# EAGLE schematic car bluetooth v1.1 (EAGLE 9.5.2)
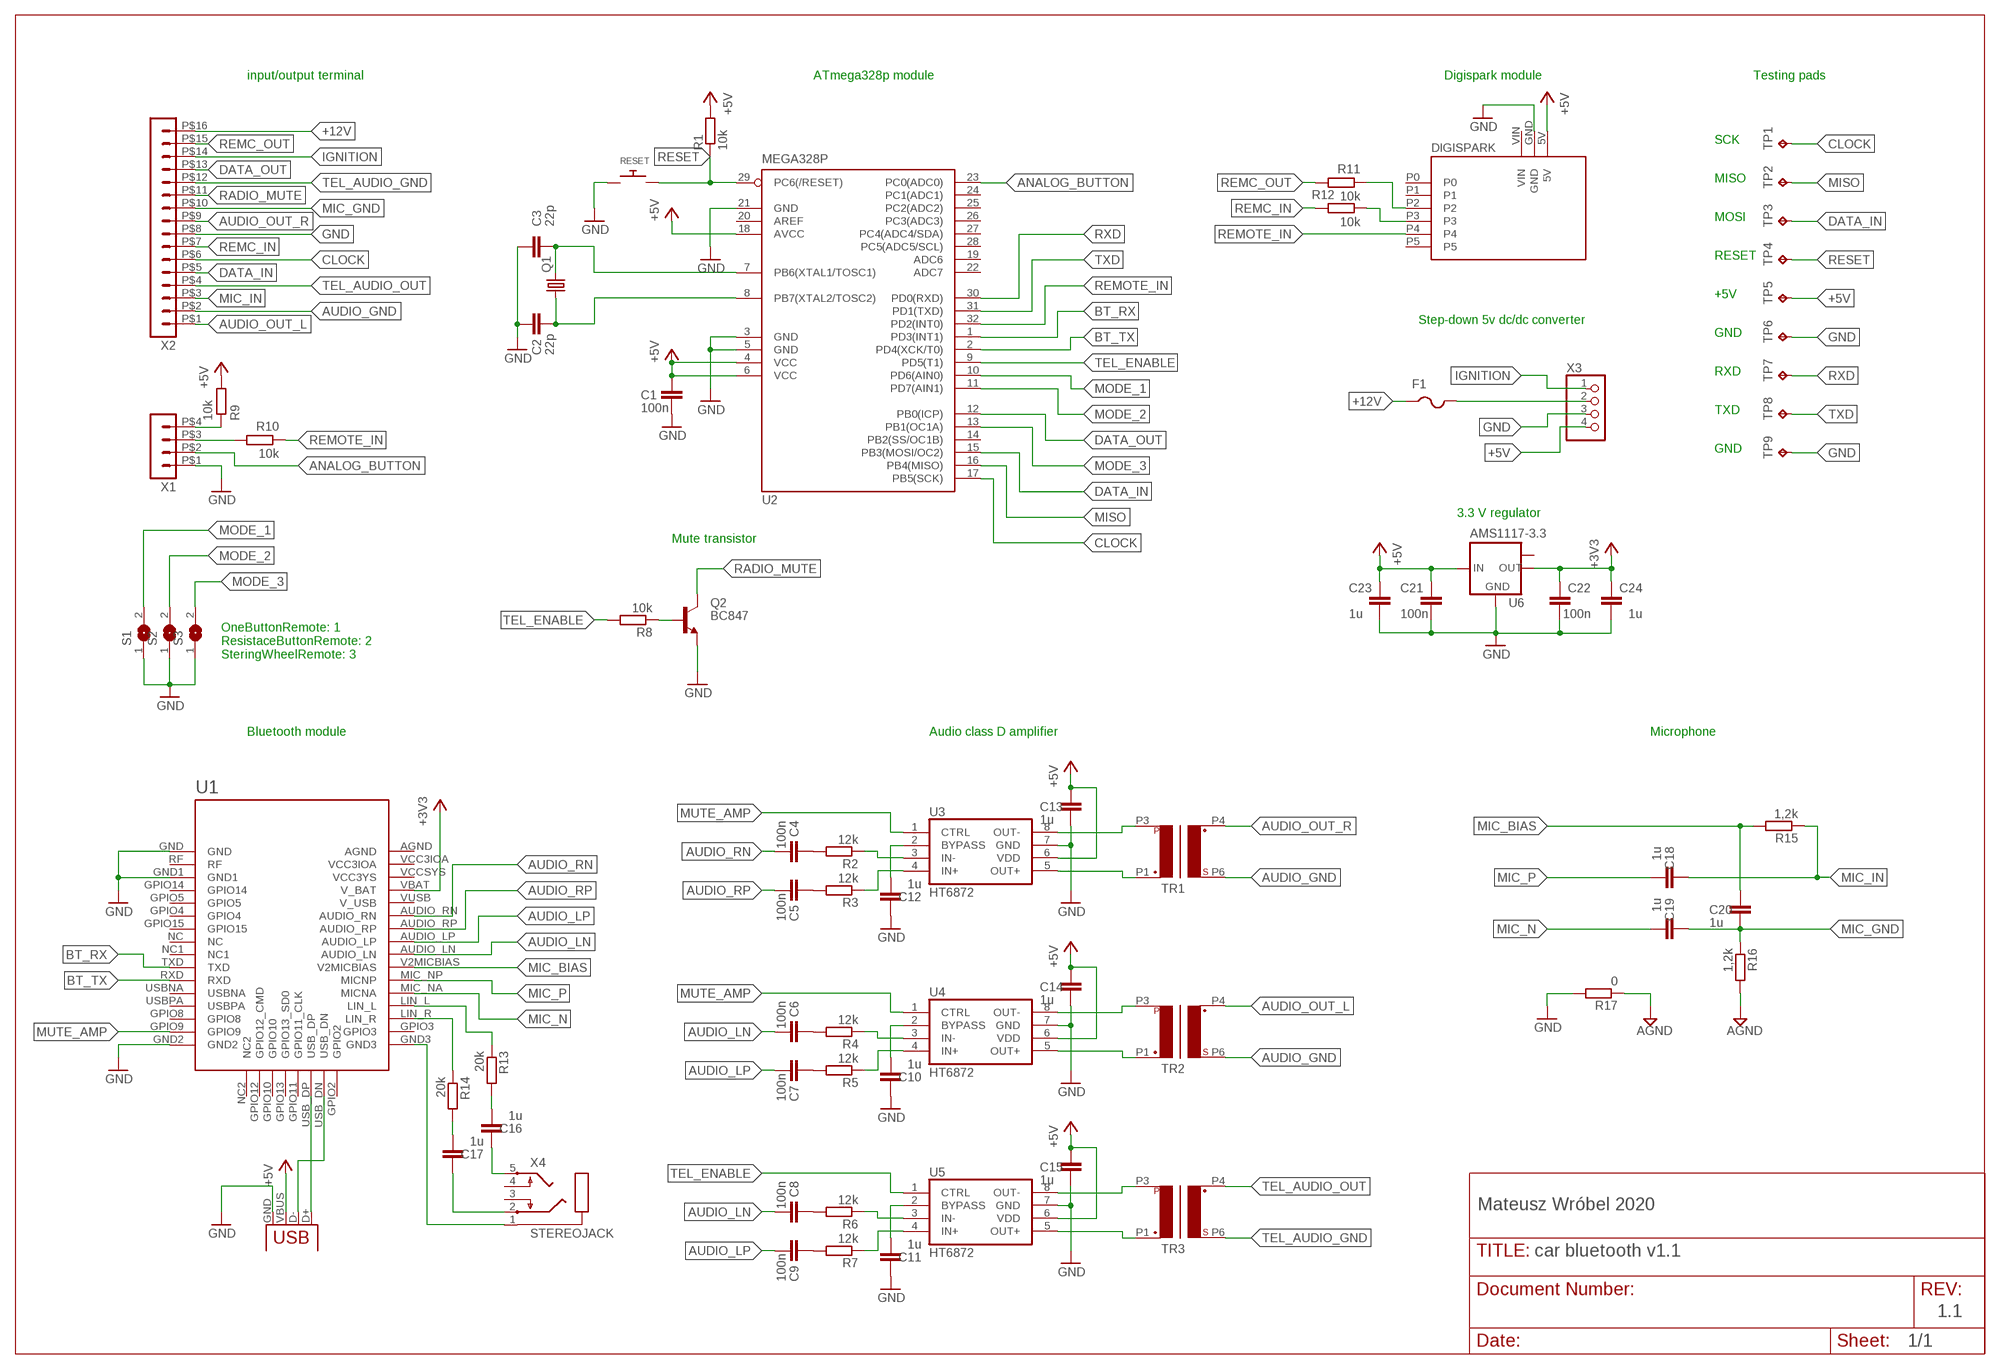
[diagram p0: schematic, sheet 1]

## Parts
C1  100n  C-EUC0805  [C0805]
C2  22p  C-EUC0805  [C0805]
C3  22p  C-EUC0805  [C0805]
C4  100n  C-EUC0805  [C0805]
C5  100n  C-EUC0805  [C0805]
C6  100n  C-EUC0805  [C0805]
C7  100n  C-EUC0805  [C0805]
C8  100n  C-EUC0805  [C0805]
C9  100n  C-EUC0805  [C0805]
C10  1u  C-EUC0805  [C0805]
C11  1u  C-EUC0805  [C0805]
C12  1u  C-EUC0805  [C0805]
C13  1u  C-EUC0805  [C0805]
C14  1u  C-EUC0805  [C0805]
C15  1u  C-EUC0805  [C0805]
C16  1u  C-EUC0805  [C0805]
C17  1u  C-EUC0805  [C0805]
C18  1u  C-EUC0805  [C0805]
C19  1u  C-EUC0805  [C0805]
C20  1u  C-EUC0805  [C0805]
C21  100n  C-EUC0805  [C0805]
C22  100n  C-EUC0805  [C0805]
C23  1u  C-EUC0805  [C0805]
C24  1u  C-EUC0805  [C0805]
F1  PTCFUSE-1206  [R1206]
Q1  CRYSTALHC49S  [HC49/S]
Q2  BC847  BC847ALT1SMD  [SOT23]
R1  10k  R-EU_R0805  [R0805]
R2  12k  R-EU_R0805  [R0805]
R3  12k  R-EU_R0805  [R0805]
R4  12k  R-EU_R0805  [R0805]
R5  12k  R-EU_R0805  [R0805]
R6  12k  R-EU_R0805  [R0805]
R7  12k  R-EU_R0805  [R0805]
R8  10k  R-EU_R0805  [R0805]
R9  10k  R-EU_R0805  [R0805]
R10  10k  R-EU_R0805  [R0805]
R11  10k  R-EU_R0805  [R0805]
R12  10k  R-EU_R0805  [R0805]
R13  20k  R-EU_R0805  [R0805]
R14  20k  R-EU_R0805  [R0805]
R15  1,2k  R-EU_R0805  [R0805]
R16  1,2k  R-EU_R0805  [R0805]
R17  0  R-EU_R0805  [R0805]
RESET  SWITCH_PUSHBUTTONSOFTTOUCHSMD_SJ  [PUSHBUTTON_SMD_SJ]
S1  SJ  [SJ]
S2  SJ  [SJ]
S3  SJ  [SJ]
TP1  TPB1,27  [B1,27]
TP2  TPB1,27  [B1,27]
TP3  TPB1,27  [B1,27]
TP4  TPB1,27  [B1,27]
TP5  TPB1,27  [B1,27]
TP6  TPB1,27  [B1,27]
TP7  TPB1,27  [B1,27]
TP8  TPB1,27  [B1,27]
TP9  TPB1,27  [B1,27]
TR1  AUDIO_R  AUDIO_ISOLATION_TRANSFORMER_EI14  [EI14]
TR2  AUDIO_L  AUDIO_ISOLATION_TRANSFORMER_EI14  [EI14]
TR3  AUDIO_MIC  AUDIO_ISOLATION_TRANSFORMER_EI14  [EI14]
U1  BK3266_BOARD  [40PIN_BOARD]
U2  MEGA328P  MEGA8-AI  [TQFP32-08]
U3  HT6872  [SO8]
U4  HT6872  [SO8]
U5  HT6872  [SO8]
U6  AMS1117-3.3  LM1117MPX-3.3  [SOT223]
U$7  DIGISPARK  [DIGISPARK]
X1  HEADER_POS4_43045-0401  [43045-0400]
X2  HEADER_POS16_43045-1600  [43045-1600]
X3  PINHD-1X4  [1X04]
X4  STEREOJACK  [STX3100]
X5  USB-A-H  [USB-A-H]

## Nets
+3V3: C22.2 C24.2 U1.VBAT(V_BAT) U6.2(OUT)
+5V: C1.1 C13.1 C14.1 C15.1 C21.1 C23.1 R1.2 R9.1 TP5.TP U2.4(VCC) U2.6(VCC) U2.18(AVCC) U3.6(VDD) U4.6(VDD) U5.6(VDD) U6.3(IN) U$7.5V X3.4 X5.VBUS
+12V: F1.1 X2.P$16
AGND: R16.2 R17.1
ANALOG_BUTTON: U2.23(PC0(ADC0)) X1.P$2
AUDIO_GND: TR1.P6(P4) TR2.P6(P4) X2.P$2
AUDIO_LN: C6.2 C8.2 U1.AUDIO_LN
AUDIO_LP: C7.2 C9.2 U1.AUDIO_LP
AUDIO_OUT_L: TR2.P4(P3) X2.P$1
AUDIO_OUT_R: TR1.P4(P3) X2.P$9
AUDIO_RN: C4.2 U1.AUDIO_RN
AUDIO_RP: C5.2 U1.AUDIO_RP
BT_RX: U1.TXD U2.1(PD3(INT1))
BT_TX: U1.RXD U2.2(PD4(XCK/T0))
CLOCK: TP1.TP U2.17(PB5(SCK)) X2.P$6
DATA_IN: TP3.TP U2.15(PB3(MOSI/OC2)) X2.P$5
DATA_OUT: U2.12(PB0(ICP)) X2.P$13
GND: C1.2 C2.1 C3.1 C10.1 C11.1 C12.1 C13.2 C14.2 C15.2 C21.2 C22.1 C23.2 C24.1 Q2.2(E) R17.2 RESET.P$1 S1.1 S2.1 S3.1 TP6.TP TP9.TP U1.GND U1.GND1 U1.GND2 U2.3(GND) U2.5(GND) U2.21(GND) U3.7(GND) U4.7(GND) U5.7(GND) U6.1(GND) U$7.GND X1.P$1 X2.P$8 X3.3 X5.GND
IGNITION: X2.P$14 X3.1
MIC_BIAS: C20.1 R15.2 U1.V2MICBIAS
MIC_GND: C19.1 C20.2 R16.1 X2.P$10
MIC_IN: C18.1 R15.1 X2.P$3
MIC_N: C19.2 U1.MIC_NA(MICNA)
MIC_P: C18.2 U1.MIC_NP(MICNP)
MISO: TP2.TP U2.16(PB4(MISO))
MODE_1: S1.2 U2.10(PD6(AIN0))
MODE_2: S2.2 U2.11(PD7(AIN1))
MODE_3: S3.2 U2.13(PB1(OC1A))
MUTE_AMP: U1.GPIO9 U3.1(CTRL) U4.1(CTRL)
N$1: R14.1 U1.LIN_R
N$2: C3.2 Q1.2 U2.7(PB6(XTAL1/TOSC1))
N$3: C2.2 Q1.1 U2.8(PB7(XTAL2/TOSC2))
N$4: Q2.1(B) R8.1
N$5: TR2.P3(P2) U4.8(OUT-)
N$6: TR2.P1 U4.5(OUT+)
N$7: TR3.P3(P2) U5.8(OUT-)
N$8: TR3.P1 U5.5(OUT+)
N$9: TR1.P1 U3.5(OUT+)
N$10: R2.1 U3.3(IN-)
N$11: R3.1 U3.4(IN+)
N$12: R4.1 U4.3(IN-)
N$13: R5.1 U4.4(IN+)
N$14: R6.1 U5.3(IN-)
N$15: R7.1 U5.4(IN+)
N$16: C5.1 R3.2
N$17: C4.1 R2.2
N$18: C6.1 R4.2
N$19: C7.1 R5.2
N$20: C8.1 R6.2
N$21: C9.1 R7.2
N$22: R9.2 X1.P$4
N$23: R10.1 X1.P$3
N$24: R12.2 U$7.P3
N$25: R11.2 U$7.P2
N$26: F1.2 X3.2
N$27: U1.USB_DP X5.D+
N$28: C12.2 U3.2(BYPASS)
N$29: C10.2 U4.2(BYPASS)
N$30: C11.2 U5.2(BYPASS)
N$31: U1.USB_DN X5.D-
N$32: R13.1 U1.LIN_L
N$33: TR1.P3(P2) U3.8(OUT-)
N$34: C17.1 X4.2
N$35: C16.1 X4.5
N$36: C17.2 R14.2
N$37: C16.2 R13.2
N$38: U1.GND3 X4.1
RADIO_MUTE: Q2.3(C) X2.P$11
REMC_IN: R12.1 X2.P$7
REMC_OUT: R11.1 X2.P$15
REMOTE_IN: R10.2 U2.32(PD2(INT0)) U$7.P4
RESET: R1.1 RESET.P$2 TP4.TP U2.29(PC6(/RESET))
RXD: TP7.TP U2.30(PD0(RXD))
TEL_AUDIO_GND: TR3.P6(P4) X2.P$12
TEL_AUDIO_OUT: TR3.P4(P3) X2.P$4
TEL_ENABLE: R8.2 U2.9(PD5(T1)) U5.1(CTRL)
TXD: TP8.TP U2.31(PD1(TXD))
Unconnected: U1.AGND U1.GPIO2 U1.GPIO3 U1.GPIO4 U1.GPIO5 U1.GPIO8 U1.GPIO10 U1.GPIO11(GPIO11_CLK) U1.GPIO12(GPIO12_CMD) U1.GPIO13(GPIO13_SD0) U1.GPIO14 U1.GPIO15 U1.NC U1.NC1 U1.NC2 U1.RF U1.USBNA U1.USBPA U1.VCC3IOA U1.VCCSYS(VCC3YS) U1.VUSB(V_USB) U2.14(PB2(SS/OC1B)) U2.19(ADC6) U2.20(AREF) U2.22(ADC7) U2.24(PC1(ADC1)) U2.25(PC2(ADC2)) U2.26(PC3(ADC3)) U2.27(PC4(ADC4/SDA)) U2.28(PC5(ADC5/SCL)) U6.TAB(OUT1) U$7.P0 U$7.P1 U$7.P5 U$7.VIN X4.3 X4.4

## Notes on the sheet
- input/output terminal | ATmega328p module | Digispark module | Testing pads
- SCK
- MISO
- MOSI
- RESET
- +5V
- Step-down 5v dc/dc converter
- GND
- RXD
- TXD
- GND
- 3.3 V regulator
- Mute transistor
- OneButtonRemote: 1
  ResistaceButtonRemote: 2
  SteringWheelRemote: 3
- Bluetooth module | Audio class D amplifier | Microphone
- Mateusz Wróbel 2020
- 1.1

## Library data of the parts
C1-C24 = rcl:C-EU: CAPACITOR, European symbol; SPICEPREFIX: C
F1 = adafruit:PTCFUSE: PTC fuses, resettable thermistors
Q1 = crystal:CRYSTAL: CRYSTAL; OC_FARNELL: 1667008; OC_NEWARK: unknown
Q2 = transistor-npn:BC847*: NPN Transistor
R1-R17 = rcl:R-EU_: RESISTOR, European symbol; SPICEPREFIX: R
RESET = adafruit:SWITCH_PUSHBUTTON: Buttons SOFTTOUCHSMD_SJ - Soft touch temporary push button (Super Junk Akihabara) Compatible with SKPMANE010 [Mouser: 688-SKPMAN] C&K_KSS = Digikey: KSS221GLFS
S1-S3 = jumper:SJ: SMD solder JUMPER
TP1-TP9 = testpad:TP: Test pad
TR1-TR3 = trafo EI14:AUDIO_ISOLATION_TRANSFORMER_EI14
U1 = BK3266:BK3266_BOARD
U2 = atmel:MEGA8: MICROCONTROLLER 8 Kbytes FLASH, 1 kbytes SRAM, 512 bytes EEPROM, USART, 6-channel 10 bit ADC, 2-channel 8 bit ADC Pin compatible with Atmega48, ATMega88, ATMega168 Source: avr.lbr; MPN: ATMEGA8-16AU; OC_FARNELL: 9171371; OC_NEWARK: 73M8863
U3-U5 = HT6872:HT6872
U6 = lm1117:LM1117MPX-*
U$7 = digispark:DIGISPARK
X1 = con-molex-micro-fit-3_0:HEADER_POS4_?: Molex - Micro-Fit 3.0 Series connector, 3.00mm (0.118") pitch header, 4 positions.
X2 = con-molex-micro-fit-3_0:HEADER_POS16_?: Molex - Micro-Fit 3.0 Series connector, 3.00mm (0.118") pitch header, 16 positions.
X3 = pinhead:PINHD-1X4: PIN HEADER
X4 = audio amplifier example:STEREOJACK: MIC/HEADPHONE JACK Stereo jack with two switches. Kycon STX3100, CUI SJ1-3555NG and/or 4UCon 05544
X5 = con-usb:USB: USB Connectors